# EAGLE design LCD_BiasSupply_Primera (EAGLE 5.11)

## Sheet 1 of 2
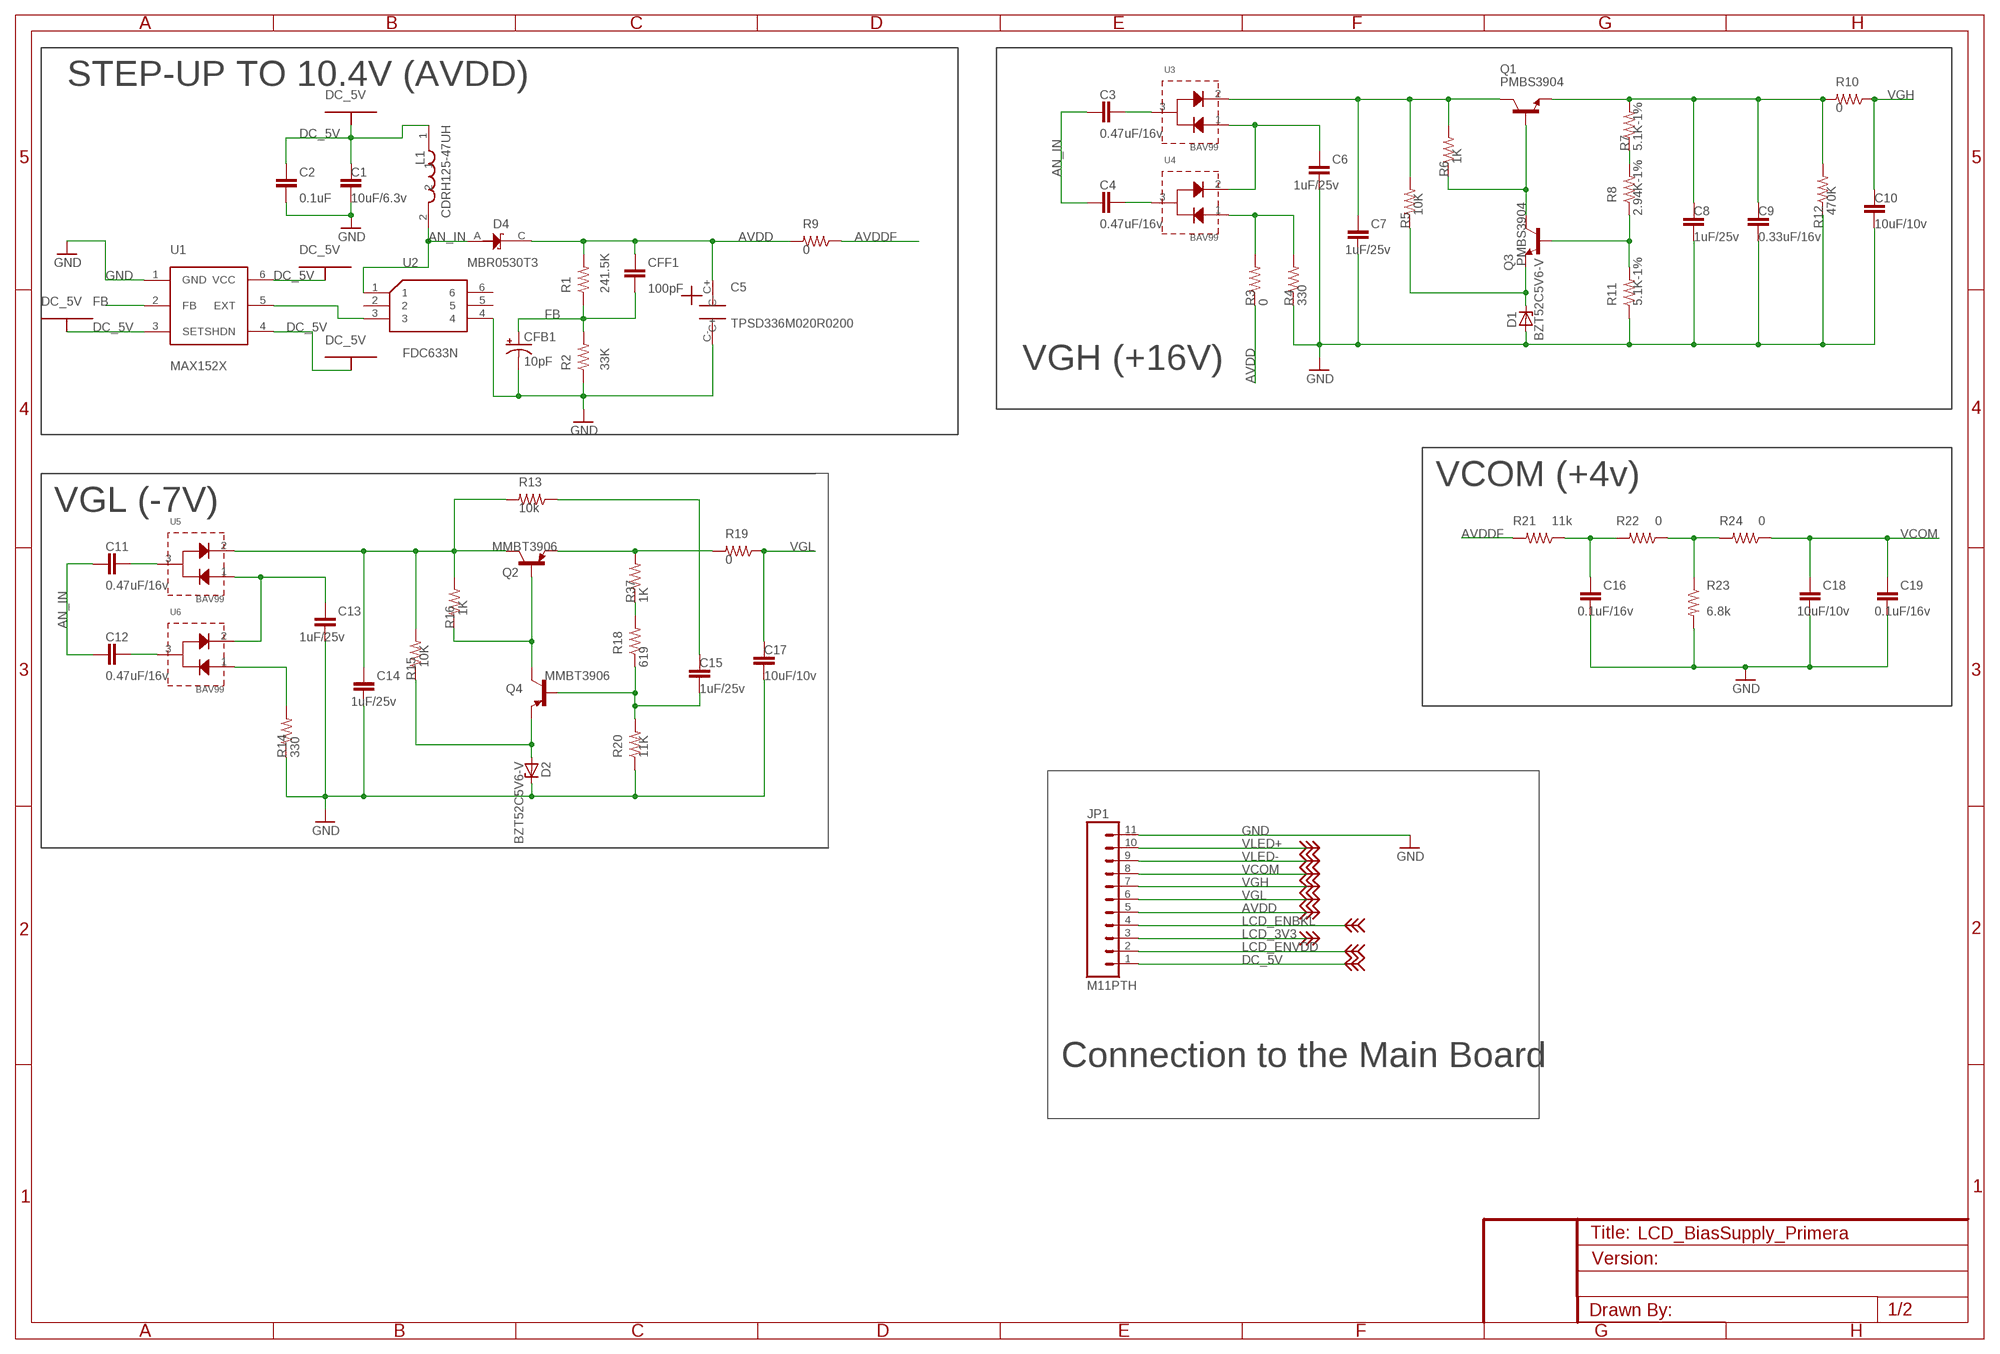
[diagram p0: schematic, sheet 1]

### Parts
C1  10uF/6.3v  CAP0603-CAP  [0603-CAP]
C2  0.1uF  CAP0603-CAP  [0603-CAP]
C3  0.47uF/16v  CAP0603-CAP  [0603-CAP]
C4  0.47uF/16v  CAP0603-CAP  [0603-CAP]
C5  TPSD336M020R0200  [2917]
C6  1uF/25v  CAP0603-CAP  [0603-CAP]
C7  1uF/25v  CAP0603-CAP  [0603-CAP]
C8  1uF/25v  CAP0603-CAP  [0603-CAP]
C9  0.33uF/16v  CAP0603-CAP  [0603-CAP]
C10  10uF/10v  CAP0603-CAP  [0603-CAP]
C11  0.47uF/16v  CAP0603-CAP  [0603-CAP]
C12  0.47uF/16v  CAP0603-CAP  [0603-CAP]
C13  1uF/25v  CAP0603-CAP  [0603-CAP]
C14  1uF/25v  CAP0603-CAP  [0603-CAP]
C15  1uF/25v  CAP0603-CAP  [0603-CAP]
C16  0.1uF/16v  CAP0603-CAP  [0603-CAP]
C17  10uF/10v  CAP0603-CAP  [0603-CAP]
C18  10uF/10v  CAP0603-CAP  [0603-CAP]
C19  0.1uF/16v  CAP0603-CAP  [0603-CAP]
CFB1  10pF  CAP_POL1206  [EIA3216]
CFF1  100pF  CAP0603-CAP  [0603-CAP]
D1  BZT52C5V6-V  [SOD123]
D2  BZT52C5V6-V  [SOD123]
D4  MBR0530T3  [SOD123]
JP1  M11PTH  [1X11]
L1  CDRH125-47UH  [CDRH12-INDUCTOR]
Q1  PMBS3904  [SOT23]
Q2  MMBT3906  [SOT23]
Q3  PMBS3904  [SOT23]
Q4  MMBT3906  [SOT23]
R1  241.5K  RESISTOR0603-RES  [0603-RES]
R2  33K  RESISTOR0603-RES  [0603-RES]
R3  0  RESISTOR0603-RES  [0603-RES]
R4  330  RESISTOR0603-RES  [0603-RES]
R5  10K  RESISTOR0603-RES  [0603-RES]
R6  1K  RESISTOR0603-RES  [0603-RES]
R7  5.1K-1%  RESISTOR0603-RES  [0603-RES]
R8  2.94K-1%  RESISTOR0603-RES  [0603-RES]
R9  0  RESISTOR0603-RES  [0603-RES]
R10  0  RESISTOR0603-RES  [0603-RES]
R11  5.1K-1%  RESISTOR0603-RES  [0603-RES]
R12  470K  RESISTOR0603-RES  [0603-RES]
R13  10k  RESISTOR0603-RES  [0603-RES]
R14  330  RESISTOR0603-RES  [0603-RES]
R15  10K  RESISTOR0603-RES  [0603-RES]
R16  1K  RESISTOR0603-RES  [0603-RES]
R18  619  RESISTOR0603-RES  [0603-RES]
R19  0  RESISTOR0603-RES  [0603-RES]
R20  11K  RESISTOR0603-RES  [0603-RES]
R21  11k  RESISTOR0603-RES  [0603-RES]
R22  0  RESISTOR0603-RES  [0603-RES]
R23  6.8k  RESISTOR0603-RES  [0603-RES]
R24  0  RESISTOR0603-RES  [0603-RES]
R37  1K  RESISTOR0603-RES  [0603-RES]
U1  MAX152X  [SOT-23-6]
U2  FDC633N  [SUPERSOT-6]
U3  BAV99  [SOT23]
U4  BAV99  [SOT23]
U5  BAV99  [SOT23]
U6  BAV99  [SOT23]

### Nets
AN_IN: C3.1 C4.1 C11.1 C12.1 D4.A L1.2 U2.1
AVDD [net_32]: C5.C+ CFF1.1 D4.C JP1.5 R1.2 R3.1 R9.2
AVDDF [net_32]: R9.1 R21.2
DC_5V [net_DC_5V]: C1.1 C2.1 JP1.1 L1.1 U1.3(SET) U1.4(SHDN) U1.6(VCC) ; also sheet 2
FB: CFB1.A(+) CFF1.2 R1.1 R2.2 U1.2(FB)
GND [net_GND]: C1.2 C2.2 C5.C- C6.2 C7.2 C8.2 C9.2 C10.2 C13.2 C14.2 C16.2 C17.2 C18.2 C19.2 CFB1.C(-) D1.A D2.C JP1.11 R2.1 R4.1 R11.1 R12.1 R14.1 R20.1 R23.2 U1.1(GND) U2.4 ; also sheet 2
LCD_3V3 [net_16]: JP1.3 ; also sheet 2
LCD_ENBKL: JP1.4 ; also sheet 2
LCD_ENVDD: JP1.2 ; also sheet 2
N$1: C7.1 Q1.3(C) R5.2 R6.2 U3.2(CATODO_D2)
N$3: C3.2 U3.3(CATD1_ANOD_D2)
N$4: C4.2 U4.3(CATD1_ANOD_D2)
N$5: C6.1 U3.1(ANODO_D1) U4.2(CATODO_D2)
N$6: R3.2 R4.2 U4.1(ANODO_D1)
N$7: C11.2 U5.3(CATD1_ANOD_D2)
N$8: Q1.1(B) Q3.3(C) R6.1
N$9: D1.C Q3.2(E) R5.1
N$11: C8.1 C9.1 Q1.2(E) R7.2 R10.2 R12.2
N$12: R7.1 R8.2
N$13: Q3.1(B) R8.1 R11.2
N$14: C12.2 U6.3(CATD1_ANOD_D2)
N$15: C13.1 U5.1(ANODO_D1) U6.2(CATODO_D2)
N$16: R14.2 U6.1(ANODO_D1)
N$17: C14.1 Q2.3(C) R13.2 R15.2 R16.2 U5.2(CATODO_D2)
N$18: Q2.1(B) Q4.3(C) R16.1
N$19: D2.A Q4.2(E) R15.1
N$20: Q2.2(E) R19.2 R37.2
N$21: R18.2 R37.1
N$22: C15.2 Q4.1(B) R18.1 R20.2
N$25: C16.1 R21.1 R22.2
N$26: R22.1 R23.1 R24.2
N$28: U1.5(EXT) U2.3
N$29: C15.1 R13.1
VCOM [net_32]: C18.1 C19.1 JP1.8 R24.1
VGH [net_32]: C10.1 JP1.7 R10.1
VGL [net_32]: C17.1 JP1.6 R19.1
VLED+ [net_32]: JP1.10 ; also sheet 2
VLED- [net_32]: JP1.9 ; also sheet 2
Unconnected: U2.2 U2.5 U2.6

### Notes on the sheet
- STEP-UP TO 10.4V (AVDD)
- VGH (+16V)
- VCOM (+4v)
- VGL (-7V)
- Connection to the Main Board

## Sheet 2 of 2
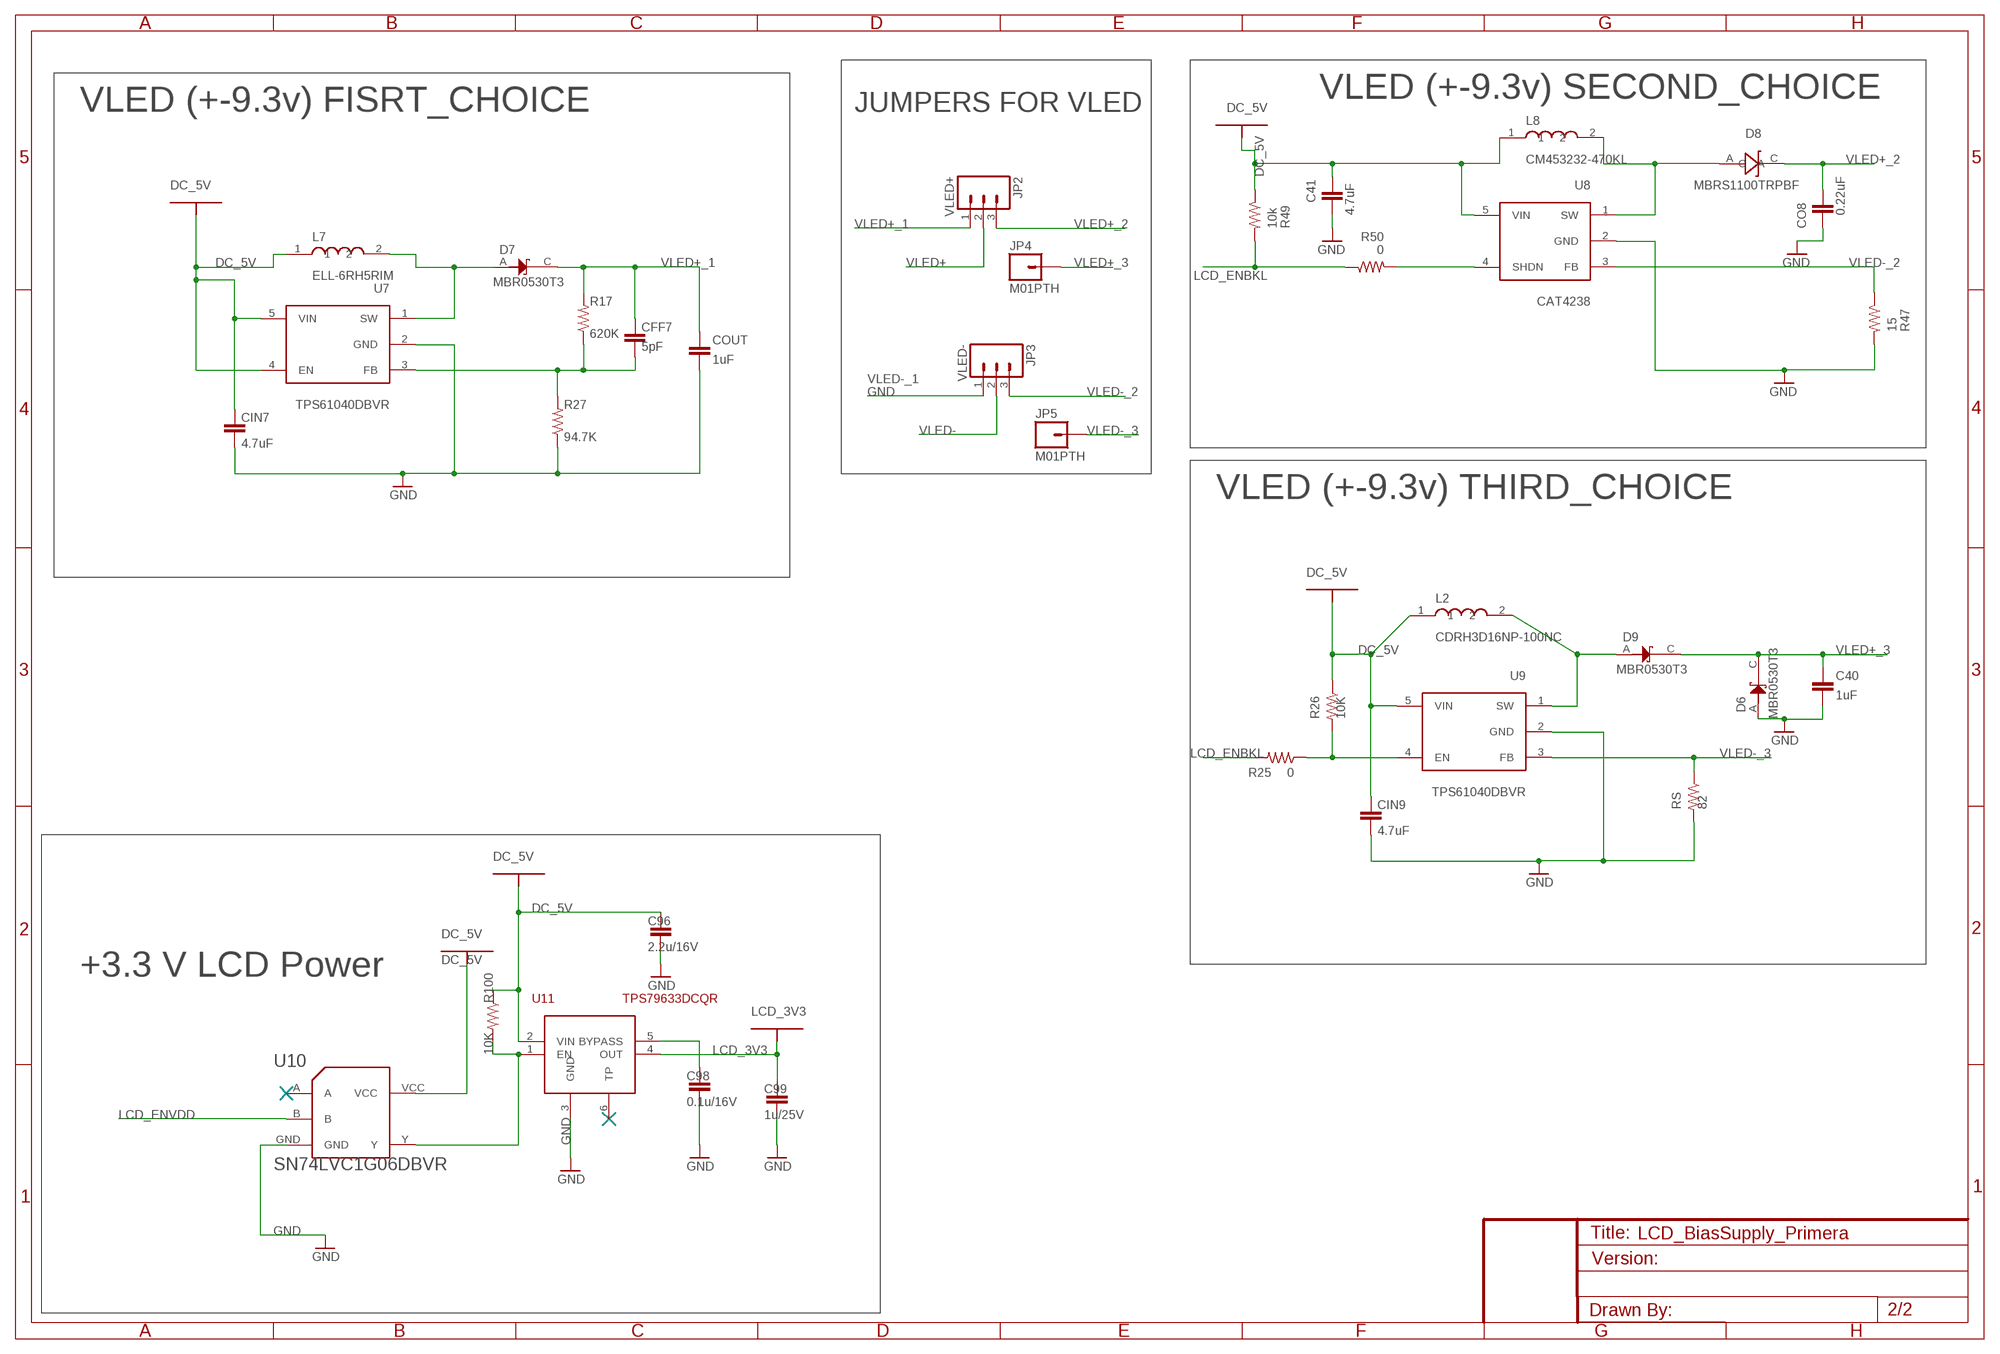
[diagram p1: schematic, sheet 2]

### Parts
C40  1uF  CAP0603-CAP  [0603-CAP]
C41  4.7uF  CAP0603-CAP  [0603-CAP]
C96  2.2u/16V  CAP0603-CAP  [0603-CAP]
C98  0.1u/16V  CAP0603-CAP  [0603-CAP]
C99  1u/25V  CAP0603-CAP  [0603-CAP]
CFF7  5pF  CAP0603-CAP  [0603-CAP]
CIN7  4.7uF  CAP0603-CAP  [0603-CAP]
CIN9  4.7uF  CAP0603-CAP  [0603-CAP]
CO8  0.22uF  CAP0603-CAP  [0603-CAP]
COUT  1uF  CAP0603-CAP  [0603-CAP]
D6  MBR0530T3  [SOD123]
D7  MBR0530T3  [SOD123]
D8  MBRS1100TRPBF  [DO-214AA]
D9  MBR0530T3  [SOD123]
JP2  VLED+  M03PTH  [1X03]
JP3  VLED-  M03PTH  [1X03]
JP4  M01PTH  [1X01]
JP5  M01PTH  [1X01]
L2  CDRH3D16NP-100NC  [CDRH3D16NP]
L7  ELL-6RH5RIM  [ELL-6RH5RIM]
L8  CM453232-470KL  [CM453232]
R17  620K  RESISTOR0603-RES  [0603-RES]
R25  0  RESISTOR0603-RES  [0603-RES]
R26  10K  RESISTOR0603-RES  [0603-RES]
R27  94.7K  RESISTOR0603-RES  [0603-RES]
R47  15  RESISTOR0603-RES  [0603-RES]
R49  10k  RESISTOR0603-RES  [0603-RES]
R50  0  RESISTOR0603-RES  [0603-RES]
R100  10K  RESISTOR0603-RES  [0603-RES]
RS  82  RESISTOR0603-RES  [0603-RES]
U7  TPS61040DBVR  [SOT23-5]
U8  CAT4238  [SOT23-5]
U9  TPS61040DBVR  [SOT23-5]
U10  SN74LVC1G06DBVR  [SOT-23-DBV]
U11  TPS79633DCQR  [SOT-223-6]

### Nets
DC_5V [net_DC_5V]: C41.2 C96.2 CIN7.1 CIN9.1 L2.1 L7.1 L8.1 R26.1 R49.1 R100.1 U7.4(EN) U7.5(VIN) U8.5(VIN) U9.5(VIN) U10.VCC U11.2(VIN) ; also sheet 1
GND [net_GND]: C40.2 C41.1 C96.1 C98.1 C99.1 CIN7.2 CIN9.2 CO8.1 COUT.2 D6.A JP3.1 R27.1 R47.2 RS.2 U7.2(GND) U8.2(GND) U9.2(GND) U10.GND U11.3(GND) ; also sheet 1
LCD_3V3 [net_16]: C99.2 U11.4(OUT) ; also sheet 1
LCD_ENBKL: R25.2 R49.2 R50.1 ; also sheet 1
LCD_ENVDD: U10.B ; also sheet 1
N$2: D9.A L2.2 U9.1(SW)
N$10: R100.2 U10.Y U11.1(EN)
N$23: C98.2 U11.5(BYPASS)
N$24: D7.A L7.2 U7.1(SW)
N$27: R50.2 U8.4(SHDN)
N$32: R25.1 R26.2 U9.4(EN)
N$34: CFF7.2 R17.1 R27.2 U7.3(FB)
N$50: D8.A L8.2 U8.1(SW)
VLED+ [net_32]: JP2.2 ; also sheet 1
VLED+_1 [net_32]: CFF7.1 COUT.1 D7.C JP2.1 R17.2
VLED+_2 [net_32]: CO8.2 D8.C JP2.3
VLED+_3 [net_32]: C40.1 D6.C D9.C JP4.1
VLED- [net_32]: JP3.2 ; also sheet 1
VLED-_2 [net_32]: JP3.3 R47.1 U8.3(FB)
VLED-_3 [net_32]: JP5.1 RS.1 U9.3(FB)
Unconnected: U10.A U11.6(TP)

### Notes on the sheet
- VLED (+-9.3v) SECOND_CHOICE
- VLED (+-9.3v) FISRT_CHOICE | JUMPERS FOR VLED
- VLED-_1
- VLED (+-9.3v) THIRD_CHOICE
- +3.3 V LCD Power

## Library data of the parts
C1-C4 C6-C19 C40 C41 C96 C98 C99 CFF1 CFF7 CIN7 CIN9 CO8 COUT = SparkFun:CAP: Capacitor Standard 0603 ceramic capacitor, and 0.1" leaded capacitor.
C5 = inferno:TPSD336M020R0200: Mouser Part #: 581-TPSD336M020R0200 Manufacturer Part #: TPSD336M020R0200 Manufacturer: AVX Description: Tantalum Capacitors - Solid SMD 33uF 20V 20% L ESR
CFB1 = SparkFun:CAP_POL: Capacitor Polarized These are standard SMD and PTH capacitors. Normally 10uF, 47uF, and 100uF in electrolytic and tantalum varieties. Always verify the external diameter of the through hole cap, it varies with capacity, voltage, and manufacturer. The EIA devices should be standard.
D1 D2 = inferno_adan:BZT52C5V6-V: Manufacturer: Vishay Mouser Part #: 625-BZT52C5V6-V Manufacturer Part #: BZT52C5V6-V-GS08 Product Category: Zener Diodes RoHS: RoHS Compliant Details Zener Voltage: 5.6 V Voltage Tolerance: 5 % Voltage Temperature Coefficient: 0.02 % / C Zener Current: 59 mA Power Dissipation: 500 mW Maximum Zener Impedance: 40 Ohms Maximum Operating Temperature: + 150 C Mounting Style: SMD/SMT Package / Case: SOD-123 Packaging: Reel Minimum Operating Temperature: - 65 C
D4 D6 D7 D9 = inferno_adan:MBR0530T3: Manufacturer: ON Semiconductor Mouser Part #: 863-MBR0530T3G Manufacturer Part #: MBR0530T3G Product Category: Schottky (Diodes & Rectifiers) RoHS: RoHS Compliant Details Product: Schottky Diodes Peak Reverse Voltage: 30 V Forward Continuous Current: 0.5 A Max Surge Current: 5.5 A Configuration: Single Forward Voltage Drop: 0.43 V Maximum Reverse Leakage Current: 130 uA Operating Temperature Range: - 65 C to + 125 C Mounting Style: SMD/SMT Package / Case: SOD-123
D8 = inferno:MBRS1100TRPBF: Mouser Part #: 844-MBRS1100TRPBF Manufacturer Part #: MBRS1100TRPBF Manufacturer: Vishay Semiconductors Description: Schottky (Diodes & Rectifiers) 1.0 Amp 100 Volt
JP1 = SparkFun:M11: Header 11 Standard 11-pin 0.1" header. Use with straight break away headers (SKU : PRT-00116), right angle break away headers (PRT-00553), swiss pins (PRT-00743), machine pins (PRT-00117), and female headers (PRT-00115).
JP2 JP3 = SparkFun:M03: Header 3 Standard 3-pin 0.1" header. Use with straight break away headers (SKU : PRT-00116), right angle break away headers (PRT-00553), swiss pins (PRT-00743), machine pins (PRT-00117), and female headers (PRT-00115). Molex polarized connector foot print use with SKU : PRT-08232 with associated crimp pins and housings.
JP4 JP5 = SparkFun:M01: Header 1 Standard 1-pin 0.1" header. Use with straight break away headers (SKU : PRT-00116), right angle break away headers (PRT-00553), swiss pins (PRT-00743), machine pins (PRT-00117), and female headers (PRT-00115).
L1 = inferno:CDRH125-47UH: Mouser Part #: 851-CDRH125NP-470MC Manufacturer Part #: CDRH125NP-470MC Manufacturer: Sumida Description: Power Inductors 47uH 1.80A 0.058ohms
L2 = inferno:CDRH3D16NP-100NC: Mouser Part #: 851-CDRH3D16NP-100NC Manufacturer Part #: CDRH3D16NP-100NC Manufacturer: Sumida Description: Power Inductors 10uH 550mA
L7 = inferno:ELL-6RH5RIM: Mouser Part #: 667-ELL-6RH5R1M Manufacturer Part #: ELL-6RH5R1M Manufacturer: Panasonic Electronic Components Description: Power Inductors 5.1UH 1550MA CHOKE
L8 = inferno:CM453232-470KL: Mouser Part #: 652-CM453232-470KL Manufacturer Part #: CM453232-470KL Manufacturer: Bourns Description: Power Inductors 47uH 10% Wirewound
Q1 Q3 = inferno_adan:PMBS3904: Manufacturer: NXP Mouser Part #: 771-PMBS3904235 Manufacturer Part #: PMBS3904,235 Product Category: Bipolar Small Signal RoHS: RoHS Compliant Details Configuration: Single Transistor Polarity: NPN Mounting Style: SMD/SMT Package / Case: SOT-23 Collector- Emitter Voltage VCEO Max: 40 V Emitter- Base Voltage VEBO: 6 V Maximum DC Collector Current: 0.1 A Power Dissipation: 250 mW Maximum Operating Frequency: 180 MHz Maximum Operating Temperature: + 150 C Packaging: Reel Minimum Operating Temperature: - 65 C
Q2 Q4 = inferno_adan:MMBT3906: Manufacturer: Fairchild Semiconductor Product Category: Bipolar Small Signal RoHS: RoHS Compliant Details Configuration: Single Transistor Polarity: PNP Mounting Style: SMD/SMT Package / Case: SOT-23 Collector- Emitter Voltage VCEO Max: 40 V Emitter- Base Voltage VEBO: - 5 V Continuous Collector Current: 0.2 A Maximum DC Collector Current: 0.2 A Power Dissipation: 350 mW Maximum Operating Frequency: 250 MHz Maximum Operating Temperature: + 150 C Packaging: Reel DC Collector/Base Gain hfe Min: 100 Minimum Operating Temperature: - 55 C
R1-R27 R37 R47 R49 R50 R100 RS = SparkFun:RESISTOR: Resistor Basic schematic elements and footprints for 0603, 1206, and PTH resistors.
U1 = inferno_adan:MAX152X: Manufacturer: Maxim Integrated Products Mouser Part #: 700-MAX1523EUTT Manufacturer Part #: MAX1523EUT+T RoHS: RoHS Compliant Details Number of Outputs: 1 Output Voltage: 2.5 V to 100 V Output Current: 0.95 A Input Voltage: 2.5 V to 5.5 V Supply Current: 25 uA Mounting Style: SMD/SMT Package / Case: SOT-23 Maximum Operating Temperature: + 85 C Packaging: Reel Minimum Operating Temperature: - 40 C
U2 = inferno:FDC633N: Mouser Part #: 512-FDC633N_F095 Manufacturer Part #: FDC633N_F095 Manufacturer: Fairchild Semiconductor Description: MOSFET Small Signal 30V 5.2A N-CH ENHANCEMENT MODE
U3-U6 = inferno_adan:BAV99: Manufacturer: NXP Mouser Part #: 771-BAV99235 Manufacturer Part #: BAV99,235 Product Category: Diodes (General Purpose,Power,Switching) RoHS: RoHS Compliant Details Product: Switching Diodes Peak Reverse Voltage: 100 V Forward Continuous Current: 0.215 A Max Surge Current: 4 A Configuration: Dual Series Recovery Time: 4 ns Forward Voltage Drop: 1.25 V Maximum Reverse Leakage Current: 0.5 uA Operating Temperature Range: + 150 C Package / Case: SOT-23 Packaging: Reel Maximum Operating Temperature: + 150 C Minimum Operating Temperature: - 65 C Mounting Style: SMD/SMT
U7 U9 = inferno_adan:TPS61040DBVR: Manufacturer: Texas Instruments Mouser Part #: 595-TPS61040DBVR Manufacturer Part #: TPS61040DBVR Product Category: LED Drivers RoHS: RoHS Compliant Details High Level Output Current: 0.09 A Operating Supply Voltage: - 0.3 V to + 7 V Maximum Supply Current: 250 mA Maximum Operating Temperature: + 85 C Mounting Style: SMD/SMT Package / Case: SOT-5 Packaging: Reel Minimum Operating Temperature: - 40 C
U8 = inferno_adan:CAT4238: Manufacturer: ON Semiconductor Mouser Part #: 698-CAT4238TDG Manufacturer Part #: CAT4238TD-GT3 Product Category: LED Drivers RoHS: RoHS Compliant Details Number of Digits: 10 High Level Output Current: 40 mA Operating Supply Voltage: 2.8 V to 5.5 V Maximum Supply Current: 1.5 mA Maximum Operating Temperature: + 85 C Mounting Style: SMD/SMT Package / Case: TSOT-23-5
U10 = inferno:SN74LVC1G06DBVR: Mouser Part #: 595-SN74LVC1G06DBVR Manufacturer Part #: SN74LVC1G06DBVR Manufacturer: Texas Instruments Description: Inverters Single Invert w/OD
U11 = inferno_adan:TPS79633DCQR: Mouser Part #: 595-TPS79633DCQR Manufacturer Part #: TPS79633DCQR Manufacturer: Texas Instruments Packege: SOT-223 - 6 pins

## Net classes
0 net_DATA: width 0.178 mm, drill 0.178 mm, clearance 0.178 mm
1 net_DC_5V: width 0.61 mm, drill 0.61 mm, clearance 0.178 mm
2 net_GND: width 0.635 mm, drill 0.508 mm
3 net_16: width 0.406 mm, drill 0.406 mm, clearance 0.178 mm
4 net_32: width 0.813 mm, drill 0.813 mm, clearance 0.178 mm

## Board
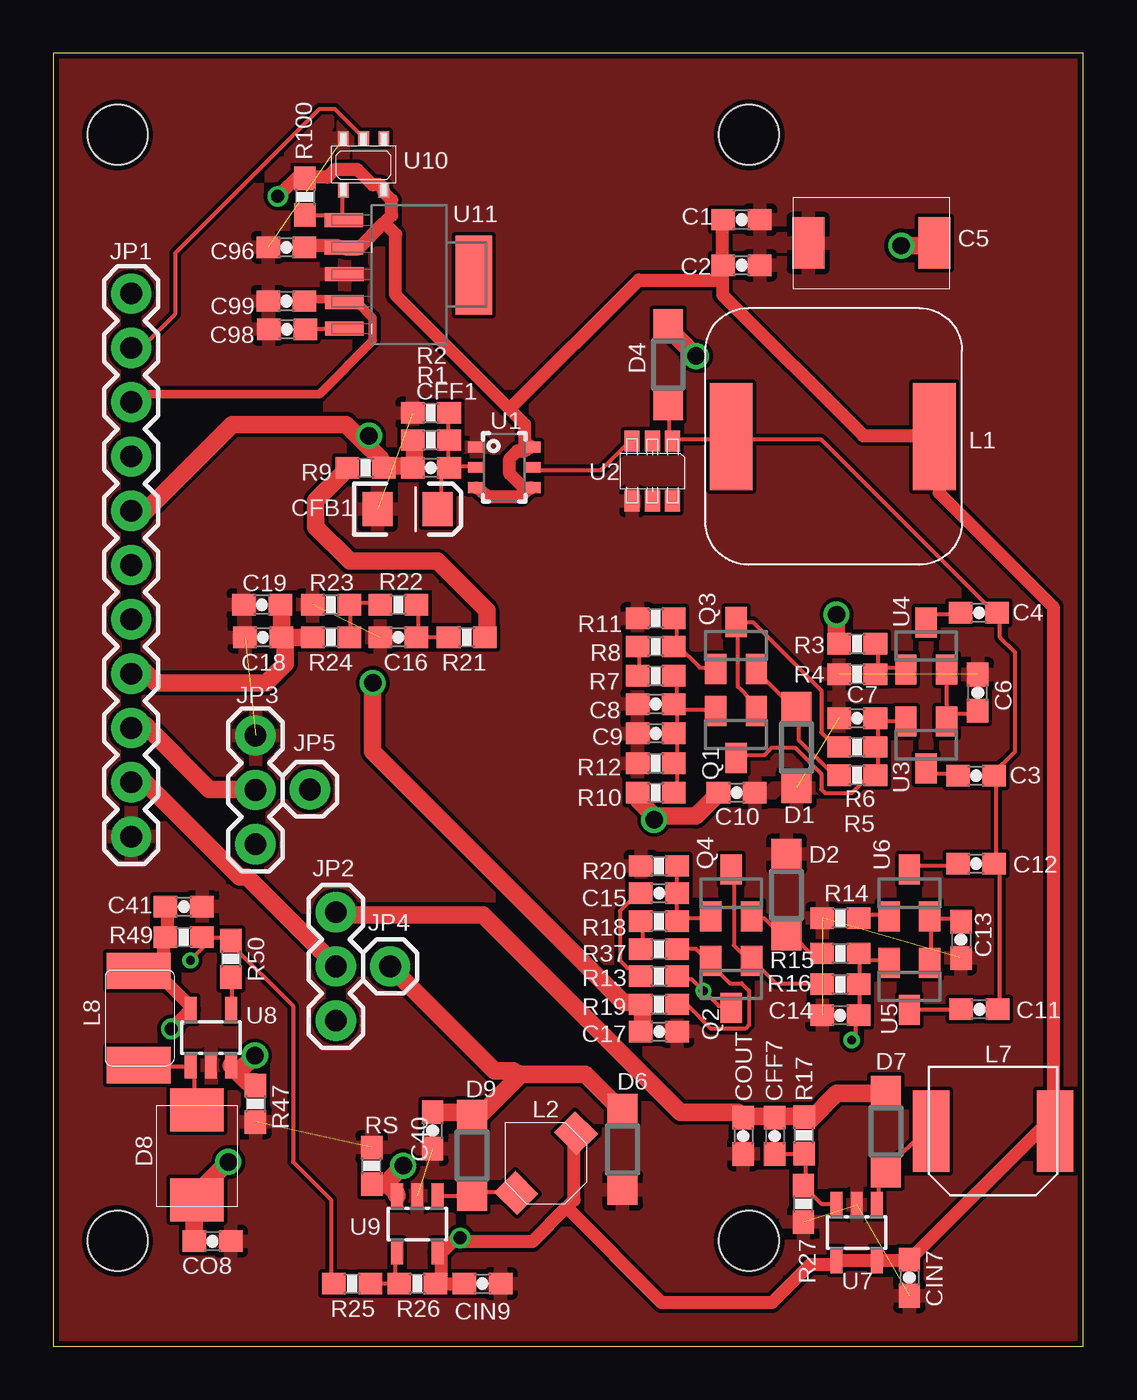
[diagram p2: board, top side]
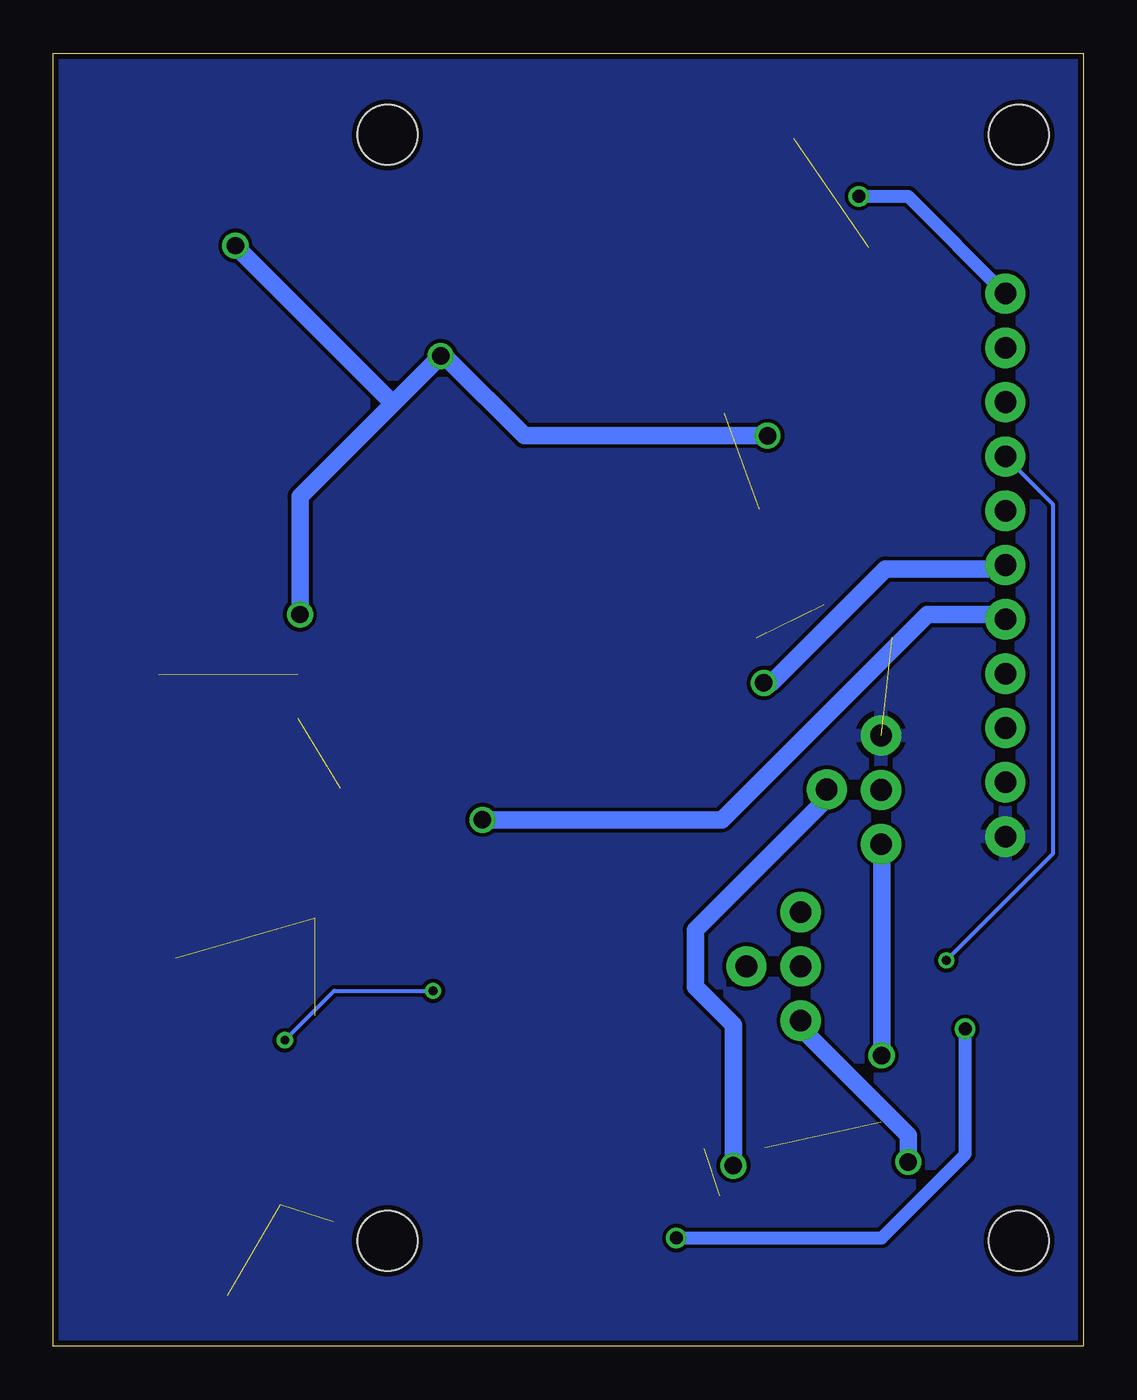
[diagram p3: board, bottom side, seen from below]

Size 48.16 x 60.45 mm. Coordinates in mm from the lower left corner, seen from the top.
Outline: 0,60.45 0,0 48.16,0 48.16,60.45 0,60.45
Copper layers (1*16): Top 0.035mm / dielectric 1.5mm / Bottom 0.035mm
Design rules "alteio_4pcb.com_2010drc": minimum track width 7mil, minimum drill 16mil, track to track 7mil, track to pad 7mil, pad to pad 7mil, via to via 7mil, smd to smd 7mil, copper to edge 10mil, drill to drill 7mil, minimum pad ring 7mil, minimum via ring 7mil, stop-mask expansion 3mil, vias tented up to drill 0mil, thermal gap 10mil
Holes 2.8 mm at 3,56.64 32.54,56.64 3,4.93 32.54,4.93

### Footprints (pad centres in the part's own frame; a part is rotated, then mirrored left to right if it is on the bottom)
0603-CAP = smd 1.1 x 1: 1 -0.85,0; 2 0.85,0
2917 = smd 1.5 x 2.4: C+ -2.8,-0.05; C- 3.1,-0.05
EIA3216 = smd 1.4 x 1.6: A 1.4,0; C -1.4,0
SOD123 = smd 1.4 x 1.4: A 1.9,0; C -1.9,0
DO-214AA = smd 2 x 2.5: A -2.1,-0.1; C 2.1,-0.1
1X11 = drill 1.016 pad 1.88 round: 1 0,0; 2 2.54,0; 3 5.08,0; 4 7.62,0; 5 10.16,0; 6 12.7,0; 7 15.24,0; 8 17.78,0; 9 20.32,0; 10 22.86,0; 11 25.4,0
1X03 = drill 1.016 pad 1.88 round: 1 0,0; 2 2.54,0; 3 5.08,0
1X01 = drill 1.016 pad 1.88 round: 1 0,0
CDRH12-INDUCTOR = smd 5 x 2: 1 0.1,-4.9; 2 0.1,4.6
CDRH3D16NP = smd 1.5 x 1.4 rotated 45: 1 -1.4,1.4; 2 1.4,-1.4
ELL-6RH5RIM = smd 1.7 x 3.8: 1 -2.9,0; 2 2.9,0
CM453232 = smd 1.7 x 3: 1 -2.2,-0.05; 2 2.2,-0.05
SOT23 = smd 1 x 1.4: 1 -0.95,-1.1; 2 0.95,-1.1; 3 0,1.1
0603-RES = smd 1.1 x 1: 1 -0.85,0; 2 0.85,0
SOT-23-6 = smd 0.51 x 0.8: 1 -0.95,-1.3; 2 0,-1.3; 3 0.95,-1.3; 4 0.95,1.3; 5 0,1.3; 6 -0.95,1.3
SUPERSOT-6 = smd 0.7 x 1: 1 -0.87,-1.48; 2 0.08,-1.48; 3 1.03,-1.48; 4 1.03,1.32; 5 0.08,1.32; 6 -0.87,1.32
SOT23-5 = smd 0.55 x 1.2: 1 -0.95,-1.3; 2 0,-1.3; 3 0.95,-1.3; 4 0.95,1.3; 5 -0.95,1.3
SOT-23-DBV = smd 0.5 x 0.65: A -0.949,-1.211; B 0.001,-1.211; GND 0.951,-1.211; VCC -0.949,1.239; Y 0.951,1.239
SOT-223-6 = smd 0.65 x 1.8: 1 -2.585,-2.995; 2 -1.31,-2.995; 3 -0.061,-2.969; 4 1.241,-2.969; 5 2.49,-2.969 | smd 3.7 x 1.7: 6 -0.024,3.075

### Placement (x,y rotation side)
C1  32.18,52.68 0 top
C2  32.18,50.55 0 top
C3  43.15,26.67 180 top
C4  43.28,34.29 180 top
C5  38.4,51.54 180 top
C6  43.23,30.56 90 top
C7  37.59,29.36 180 top
C8  28.17,30.02 180 top
C9  28.17,28.65 180 top
C10  31.95,25.88 0 top
C11  43.31,15.75 180 top
C12  43.15,22.56 180 top
C13  42.44,19 270 top
C14  36.8,15.47 180 top
C15  28.32,21.18 0 top
C16  16.13,33.15 180 top
C17  28.32,14.71 0 top
C18  9.8,33.15 180 top
C19  9.75,34.67 180 top
C40  17.73,10.08 270 top
C41  6.1,20.55 180 top
C96  10.9,51.38 0 top
C98  10.92,47.55 0 top
C99  10.9,48.87 0 top
CFB1  16.56,39.14 0 top
CFF1  17.65,41.07 0 top
CFF7  33.73,9.83 270 top
CIN7  40.03,3.2 270 top
CIN9  20.07,2.92 0 top
CO8  7.44,4.9 180 top
COUT  32.26,9.83 270 top
D1  34.75,27.99 270 top
D2  34.29,21.11 270 top
D4  28.75,45.9 270 top
D6  26.62,9.19 270 top
D7  38.94,10.03 270 top
D8  6.81,8.94 270 top
D9  19.58,8.92 270 top
JP1  3.63,49.23 270 top
JP2  13.21,20.29 270 top
JP3  9.45,28.55 270 top
JP4  15.75,17.75 270 top
JP5  11.99,26.03 270 top
L1  36.3,42.44 90 top
L2  23.04,8.56 270 top
L7  43.94,10.06 180 top
L8  4.04,15.34 270 top
Q1  31.93,28.6 180 top
Q2  31.7,16.92 180 top
Q3  31.93,32.77 0 top
Q4  31.7,21.18 0 top
R1  17.65,42.37 180 top
R2  17.65,43.64 0 top
R3  37.59,32.84 0 top
R4  37.59,31.42 0 top
R5  37.59,26.7 0 top
R6  37.59,28.02 0 top
R7  28.17,31.34 0 top
R8  28.17,32.72 180 top
R9  14.61,41.07 0 top
R10  28.17,25.88 0 top
R11  28.17,34.04 0 top
R12  28.17,27.25 0 top
R13  28.32,17.3 0 top
R14  36.8,20.02 0 top
R15  36.8,18.36 0 top
R16  36.8,16.92 0 top
R17  35.1,9.86 90 top
R18  28.32,19.86 180 top
R19  28.32,15.98 0 top
R20  28.32,22.45 0 top
R21  19.33,33.15 0 top
R22  16.13,34.67 0 top
R23  12.98,34.67 180 top
R24  12.98,33.15 0 top
R25  13.97,2.92 180 top
R26  17.02,2.92 180 top
R27  35.08,6.65 90 top
R37  28.32,18.57 0 top
R47  9.45,11.33 270 top
R49  6.1,19.13 0 top
R50  8.31,18.11 270 top
R100  11.76,53.75 270 top
RS  14.88,8.43 90 top
U1  21.08,41.1 270 top
U2  28.09,40.84 180 top
U3  40.82,28.12 180 top
U4  40.82,32.74 0 top
U5  40.03,16.81 180 top
U6  40.03,21.18 0 top
U7  37.57,5.31 180 top
U8  7.37,14.43 0 top
U9  17.02,5.71 180 top
U10  14.5,55.27 180 top
U11  16.59,50.06 270 top

### Tracks (layer width: path | path; a pad name or v marks a point on that pad's centre or on a via)
AN_IN
  Top 0.178: D4.A 28.8,43.99 28.8,42.39 U2.1 28.98,42.39 31.65,42.39 L1.2 31.83,42.39 35.92,42.39 44.09,34.21 C4.1 44.27,34.21 44.27,33.15 44.98,32.44 44.98,27.81 43.92,26.75 C3.1 44.09,26.57 44.09,22.66 C12.1 44.09,22.48 44.27,22.3 44.27,15.9 C11.1
AVDD  (via drill 0.81)
  Top 0.813: R1.2 16.89,42.22 16.89,41.5 CFF1.1 16.71,41.15 15.47,41.15 R9.2 15.29,41.5 14.49,42.3 | 14.49,42.3 13.69,43.1 8.36,43.1 4.27,39.01 3.73,39.01 JP1.5 | v36.63,34.21 36.63,32.97 R3.1 | v30.05,46.3 28.63,47.73 D4.C | v39.65,51.46 41.07,51.46 C5.C+ | 14.49,42.3 v14.76,42.57
  Bottom 0.813: v36.63,34.21 36.63,39.73 32.27,44.08 | 32.27,44.08 v30.05,46.3 29.69,46.13 26.14,42.57 v14.76,42.57 | 32.27,44.08 v39.65,51.46
AVDDF
  Top 0.813: R9.1 13.69,40.97 12.27,39.55 12.27,38.3 13.87,36.7 17.96,36.7 20.27,34.39 20.27,33.15 R21.2
DC_5V  (via drill 0.61)
  Top 0.61: C1.1 31.29,52.53 31.29,50.57 C2.1 31.29,50.39 31.29,49.86 | 31.29,49.86 31.29,49.15 37.87,42.57 41.07,42.57 L1.1 41.43,42.39 41.43,39.9 46.76,34.57 46.76,10.39 L7.1 46.76,10.21 46.23,10.21 40.18,4.17 CIN7.1 40.01,3.99 38.58,3.99 U7.5 38.23,3.99 36.63,3.99 U7.4 36.45,3.81 35.38,3.81 33.6,2.03 28.45,2.03 24,6.48 | U1.3 19.91,40.08 20.27,39.73 21.87,39.73 22.23,40.08 U1.4 22.05,40.08 21.34,40.79 21.34,41.5 21.69,41.86 22.05,41.86 22.23,42.04 U1.6 22.05,42.22 22.05,43.1 21.34,43.81 | 15.47,52.53 14.22,51.28 13.69,51.28 U11.2 13.34,51.46 11.91,51.46 C96.2 | 15.47,52.53 15.82,52.88 15.82,53.59 15.47,53.95 U10.VCC 15.29,54.3 14.94,54.3 14.22,55.02 13.16,55.02 12.8,54.66 11.91,54.66 R100.1 11.56,54.84 v10.49,53.77 | 21.34,43.81 16,49.15 16,51.99 15.47,52.53 | 31.29,49.86 27.38,49.86 21.34,43.81 | C41.2 5.33,20.52 5.33,19.28 R49.1 5.16,18.92 5.16,17.5 L8.1 4.09,17.5 4.8,17.5 6.4,15.9 U8.5 6.22,15.55 v5.51,14.83 | CIN9.1 R26.1 18.14,3.1 18.14,4.34 | 18.14,4.34 U9.5 | 24,6.48 22.4,4.88 19.02,4.88 | 24,6.48 24.36,6.83 24.36,9.85 L2.1 | 19.02,4.88 18.67,4.88 18.14,4.34 | 19.02,4.88 v19.02,5.05
  Bottom 0.61: v10.49,53.77 8.18,53.77 JP1.1 | v5.51,14.83 5.51,8.97 9.42,5.05 v19.02,5.05
FB
  Top 0.178: U1.2 19.74,41.15 18.67,41.15 CFF1.2 | CFF1.2 18.49,41.15 18.49,42.22 R1.1 18.49,42.39 R2.2 | CFB1.A 18.14,39.19 18.14,40.61 18.49,40.97 CFF1.2
GND  (12 unrouted)
  pour Bottom: 0,60.45 48.16,60.45 48.16,0 0,0
  pour Top: 0,60.45 48.16,60.45 48.16,0 0,0
LCD_3V3
  Top 0.406: C99.2 11.91,48.97 13.51,48.97 U11.4 13.69,48.79 14.22,48.79 14.94,48.08 14.94,47.02 12.45,44.53 4.09,44.53 3.73,44.17 JP1.3
LCD_ENBKL  (via drill 0.41)
  Top 0.178: 7.47,19.1 7.11,19.1 R49.2 7.47,19.1 | 7.47,19.1 8.18,19.1 R50.1 8.18,18.92 11.2,15.9 11.2,8.61 12.98,6.83 12.98,2.92 R25.2 | v6.4,18.03 7.47,19.1
  Bottom 0.178: v6.4,18.03 1.42,23.01 1.42,39.37 3.56,41.5 JP1.4
LCD_ENVDD
  Top 0.178: U10.B 14.4,56.62 13.16,57.86 12.45,57.86 5.69,51.1 5.69,48.26 4.27,46.84 3.73,46.84 JP1.2
N$1
  Top 0.178: 38.58,27.1 38.58,27.99 R6.2 38.58,28.17 38.58,29.23 | 38.58,27.1 38.58,26.75 R5.2 38.58,27.1 | 38.58,27.1 37.34,25.86 36.09,25.86 35.92,26.03 35.92,26.75 34.67,27.99 33.6,27.99 33.25,27.63 32,27.63 Q1.3 | 38.58,29.23 39.83,29.23 U3.2 | 38.58,29.23 C7.1
N$2
  Top 0.178: U9.1 18.14,7.01 19.56,7.01 D9.A 19.74,7.19 21.51,7.19 L2.2
N$3
  Top 0.178: C3.2 42.14,26.75 41.07,26.75 40.89,26.92 U3.3
N$4
  Top 0.178: C4.2 42.32,34.21 41.25,34.21 40.89,33.86 U4.3
N$5
  Top 0.178: 41.78,29.23 42.14,29.59 43.2,29.59 C6.1 | 41.78,29.23 41.78,31.55 U4.2 | U3.1 41.78,29.23
N$6
  Top 0.178: 38.58,31.72 38.58,32.79 R3.2 | 38.58,31.72 38.58,31.55 R4.2 38.58,31.72 | 38.58,31.72 39.83,31.72 U4.1
N$7
  Top 0.178: C11.2 42.32,15.72 40.18,15.72 U5.3
N$8
  Top 0.178: 32,33.86 32.72,33.86 35.92,30.66 35.92,28.7 36.45,28.17 36.63,28.17 R6.1 | 32,33.86 32,30.84 32.72,30.12 32.72,29.77 Q1.1 | 32,33.86 Q3.3
N$9
  Top 0.178: R5.1 36.63,26.75 36.45,26.75 34.85,28.35 34.85,29.77 D1.C 34.67,29.77 32.89,31.55 Q3.2
N$10
  Top 0.178: 13.51,52.88 13.51,52.7 U11.1 13.51,52.88 | 13.51,52.88 13.51,53.95 U10.Y | 13.51,52.88 11.91,52.88 R100.2
N$11
  Top 0.178: R10.2 29.16,26.03 29.16,27.1 R12.2 29.16,27.28 29.16,28.52 C9.1 29.16,28.7 29.16,29.77 | 29.16,29.77 29.16,29.95 C8.1 | R7.2 29.16,31.19 29.16,30.12 C8.1 | 29.16,29.77 30.94,29.77 Q1.2 | C8.1 29.16,29.77
N$12
  Top 0.178: R7.1 27.38,31.37 27.38,32.61 R8.2
N$13
  Top 0.178: 29.16,32.79 29.16,34.04 R11.2 | 29.16,32.79 30.23,31.72 30.94,31.72 Q3.1 | 29.16,32.79 R8.1
N$14
  Top 0.178: C12.2 42.14,22.48 40.36,22.48 40.18,22.3 U6.3
N$15
  Top 0.178: 41.07,19.99 42.32,19.99 C13.1 | 41.07,19.99 41.07,18.03 U5.1 | 41.07,19.99 U6.2
N$16
  Top 0.178: R14.2 37.69,20.17 38.94,20.17 U6.1
N$17  (via drill 0.41)
  Top 0.178: R13.2 29.34,17.14 29.87,17.14 v30.4,16.61 31.11,15.9 31.65,15.9 Q2.3 | 37.69,18.03 37.69,16.97 R16.2 37.69,16.79 37.69,15.55 C14.1 37.52,15.37 37.52,14.48 v37.34,14.3 | 37.69,18.03 37.69,18.21 R15.2 37.69,18.03 | 37.69,18.03 38.94,18.03 U5.2
  Bottom 0.178: v30.4,16.61 35.03,16.61 v37.34,14.3
N$18
  Top 0.178: R16.1 35.92,16.97 33.78,16.97 32.72,18.03 Q2.1 32.54,18.03 31.83,18.74 31.83,22.12 Q4.3
N$19
  Top 0.178: R15.1 35.92,18.39 35.38,18.39 34.67,19.1 34.31,19.1 D2.A 34.14,19.1 33.25,19.99 32.72,19.99 Q4.2
N$20
  Top 0.178: R19.2 29.34,15.9 29.69,15.9 30.76,14.83 32.36,14.83 32.54,15.01 32.54,16.61 32.18,16.97 31.65,16.97 30.76,17.86 Q2.2 30.58,18.03 30.05,18.57 R37.2
N$21
  Top 0.178: R37.1 27.56,18.57 27.56,19.81 R18.2
N$22
  Top 0.178: R20.2 29.16,22.3 29.16,21.23 C15.2 29.16,21.06 29.16,19.99 R18.1 29.34,19.99 30.58,19.99 Q4.1
N$23
  Top 0.178: C98.2 13.51,47.55 U11.5
N$24
  Top 0.178: U7.1 38.58,6.66 38.58,7.72 38.94,8.08 D7.A 38.94,8.25 40.89,10.21 L7.2
N$25
  Top 0.178: R21.1 17.07,33.15 | 17.07,33.15 17.07,34.57 R22.2 | 17.07,33.15 C16.1
N$26
  Top 0.178: R24.2 13.87,33.15 13.87,34.57 R23.1 13.87,34.75 15.11,34.75 R22.1
N$27
  Top 0.178: R50.2 8.36,17.14 8.36,15.9 U8.4
N$28
  Top 0.178: U1.5 22.4,40.97 25.6,40.97 27.03,42.39 U2.3
N$29
  Top 0.178: R13.1 27.38,17.32 27.03,17.68 26.85,17.68 26.49,18.03 26.49,20.34 27.38,21.23 C15.1
N$32
  Top 0.178: 16,2.92 R25.1 | 16,2.92 16,4.34 U9.4 | R26.2 16,2.92
N$34
  Top 0.178: CFF7.2 33.78,8.97 35.03,8.97 R17.1 35.2,8.97 35.2,7.54 R27.2 35.2,7.37 35.92,6.66 36.45,6.66 U7.3
N$50
  Top 0.178: D8.A 6.58,11.1 6.58,13.06 U8.1 6.4,13.06 4.09,13.06 L8.2
VCOM
  Top 0.813: C19.1 10.67,34.57 10.67,33.15 C18.1 | C18.1 R24.1 | C18.1 10.85,32.79 10.85,31.9 9.96,31.01 4.8,31.01 4.27,31.55 3.73,31.55 JP1.8
VGH  (via drill 0.81)
  Top 0.813: 28.09,24.79 27.38,25.5 27.38,25.86 R10.1 | 28.09,24.79 30.05,24.79 31.11,25.86 C10.1 | 28.09,24.79 v28.09,24.61
  Bottom 0.813: v28.09,24.61 16.89,24.61 7.29,34.21 3.91,34.21 3.73,34.04 JP1.7
VGL  (via drill 0.81)
  Top 0.813: C17.1 27.56,14.83 27.56,15.9 R19.1 27.2,16.08 26.67,16.08 14.94,27.81 v14.94,31.01
  Bottom 0.813: v14.94,31.01 14.58,31.01 9.25,36.35 3.91,36.35 3.73,36.52 JP1.6
VLED+
  Top 0.813: JP2.2 13.16,17.86 9.07,21.95 8.71,21.95 4.27,26.39 3.73,26.39 JP1.10
VLED+_1
  Top 0.813: D7.C 38.94,11.81 36.63,11.81 35.38,10.57 R17.2 35.03,10.74 33.96,10.74 CFF7.1 33.6,10.74 32.36,10.74 COUT.1 32,10.92 29.34,10.92 20.09,20.17 13.34,20.17 JP2.1
VLED+_2  (via drill 0.81)
  Top 0.813: CO8.2 6.58,5.05 6.58,6.83 D8.C 6.76,7.19 v8.18,8.61
  Bottom 0.813: v8.18,8.61 8.18,9.85 13.16,14.83 13.16,15.19 JP2.3
VLED+_3
  Top 0.813: C40.1 17.78,10.92 19.56,10.92 D9.C 19.91,10.74 21.87,12.7 | 21.87,12.7 24.89,12.7 26.49,11.1 D6.C | JP4.1 20.62,12.88 21.51,12.88 21.87,12.7
VLED-
  Top 0.813: JP3.2 9.42,26.03 7.29,26.03 4.27,29.06 3.73,29.06 JP1.9
VLED-_2  (via drill 0.81)
  Top 0.813: 8.62,12.79 8.36,13.06 U8.3 | 8.62,12.79 9.07,12.34 9.42,12.34 R47.1 | v9.42,13.59 8.62,12.79
  Bottom 0.813: v9.42,13.59 9.42,23.37 JP3.3
VLED-_3  (via drill 0.81)
  Top 0.813: 15.65,7.54 14.94,7.54 RS.1 | 15.65,7.54 16,7.19 U9.3 | v16.36,8.43 15.82,7.9 15.65,7.54
  Bottom 0.813: v16.36,8.43 16.36,15.01 18.14,16.79 18.14,19.46 12.09,25.5 12.09,26.03 JP5.1